# EAGLE design andromeda (EAGLE 7.7.0)
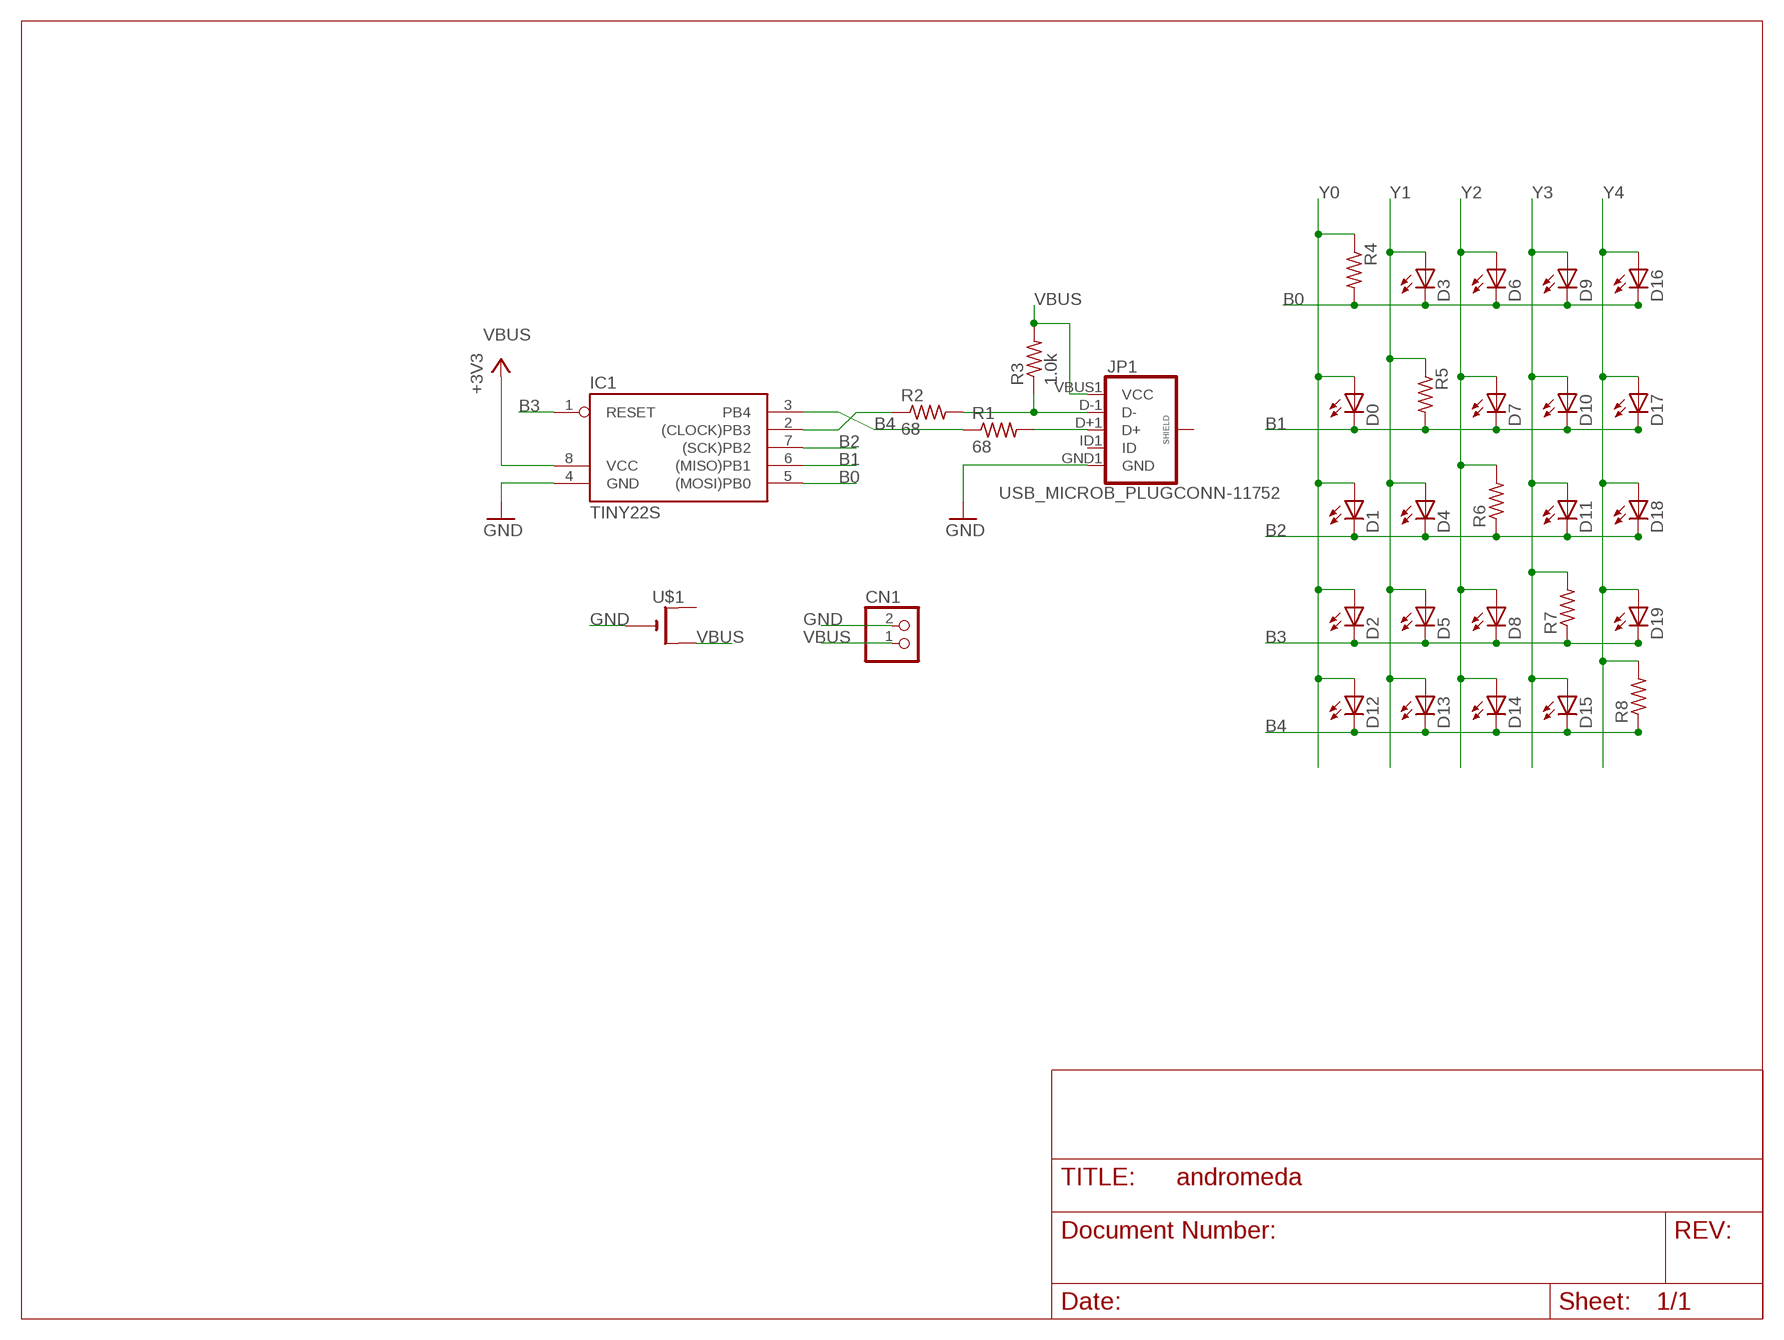
[diagram p0: schematic, sheet 1]

## Parts
CN1  JST_2PIN-THM-RA  [JST-PH-2-THM-RA]
D0  LEDCHIPLED_0805  [CHIPLED_0805]
D1  LEDCHIPLED_0805  [CHIPLED_0805]
D2  LEDCHIPLED_0805  [CHIPLED_0805]
D3  LEDCHIPLED_0805  [CHIPLED_0805]
D4  LEDCHIPLED_0805  [CHIPLED_0805]
D5  LEDCHIPLED_0805  [CHIPLED_0805]
D6  LEDCHIPLED_0805  [CHIPLED_0805]
D7  LEDCHIPLED_0805  [CHIPLED_0805]
D8  LEDCHIPLED_0805  [CHIPLED_0805]
D9  LEDCHIPLED_0805  [CHIPLED_0805]
D10  LEDCHIPLED_0805  [CHIPLED_0805]
D11  LEDCHIPLED_0805  [CHIPLED_0805]
D12  LEDCHIPLED_0805  [CHIPLED_0805]
D13  LEDCHIPLED_0805  [CHIPLED_0805]
D14  LEDCHIPLED_0805  [CHIPLED_0805]
D15  LEDCHIPLED_0805  [CHIPLED_0805]
D16  LEDCHIPLED_0805  [CHIPLED_0805]
D17  LEDCHIPLED_0805  [CHIPLED_0805]
D18  LEDCHIPLED_0805  [CHIPLED_0805]
D19  LEDCHIPLED_0805  [CHIPLED_0805]
IC1  TINY22S  [SOIC8]
JP1  USB_MICROB_PLUGCONN-11752  [USB-B-MICRO-SMD_V03]
R1  68  R-US_R0603  [R0603]
R2  68  R-US_R0603  [R0603]
R3  1.0k  R-US_R0603  [R0603]
R4  R-US_R0603  [R0603]
R5  R-US_R0603  [R0603]
R6  R-US_R0603  [R0603]
R7  R-US_R0603  [R0603]
R8  R-US_R0603  [R0603]
U$1  CR2032SMT  [CR2032-SMD]

## Nets
B0: D3.C D6.C D9.C D16.C IC1.5((MOSI)PB0) R4.2
B1: D0.C D7.C D10.C D17.C IC1.6((MISO)PB1) R5.2
B2: D1.C D4.C D11.C D18.C IC1.7((SCK)PB2) R6.1
B3: D2.C D5.C D8.C D19.C IC1.1(RESET) R7.1
B4: D12.C D13.C D14.C D15.C IC1.3(PB4) R1.1 R8.1
GND: CN1.2 IC1.4(GND) JP1.GND1(GND) U$1.-
N$1: JP1.D+1(D+) R1.2
N$2: JP1.D-1(D-) R2.2 R3.1
N$4: IC1.2((CLOCK)PB3) R2.1
VBUS: CN1.1 IC1.8(VCC) JP1.VBUS1(VCC) R3.2 U$1.+$2(+1) ; supply symbol labelled +3V3
Y0: D0.A D1.A D2.A D12.A R4.1
Y1: D3.A D4.A D5.A D13.A R5.1
Y2: D6.A D7.A D8.A D14.A R6.2
Y3: D9.A D10.A D11.A D15.A R7.2
Y4: D16.A D17.A D18.A D19.A R8.2
Unconnected: JP1.ID1(ID) JP1.SHIELD1(SHIELD) JP1.SHIELD2(SHIELD) JP1.SHIELD3(SHIELD) U$1.+$1(+)

## Library data of the parts
CN1 = adafruit:JST_2PIN: JST 2-Pin Connectors of various flavors SMT-RA (S2B-PH-SM4) 4UConnector #17311 SMT (B2B-PH-SM4) THM-RA (S2B-PH) THM (B2B-PH)
D0 D1-D19 = led:LED: LED OSRAM: - CHIPLED LG R971, LG N971, LY N971, LG Q971, LY Q971, LO R971, LY R971 LH N974, LH R974 LS Q976, LO Q976, LY Q976 LO Q996 - Hyper CHIPLED LW Q18S LB Q993, LB Q99A, LB R99A - SideLED LS A670, LO A670, LY A670, LG A670, LP A670 LB A673, LV A673, LT A673, LW A673 LH A674 LY A675 LS A676, LA A676, LO A676, LY A676, LW A676 LS A679, LY A679, LG A679 - Hyper Micro SIDELED® LS Y876, LA Y876, LO Y876, LY Y876 LT Y87S - SmartLED LW L88C, LW L88S LB L89C, LB L89S, LG L890 LS L89K, LO L89K, LY L89K LS L896, LA L896, LO L896, LY L896 - TOPLED LS T670, LO T670, LY T670, LG T670, LP T670 LSG T670, LSP T670, LSY T670, LOP T670, LYG T670 LG T671, LOG T671, LSG T671 LB T673, LV T673, LT T673, LW T673 LH T674 LS T676, LA T676, LO T676, LY T676, LB T676, LH T676, LSB T676, LW T676 LB T67C, LV T67C, LT T67C, LS T67K, LO T67K, LY T67K, LW E67C LS E67B, LA E67B, LO E67B, LY E67B, LB E67C, LV E67C, LT E67C LW T67C LS T679, LY T679, LG T679 LS T770, LO T770, LY T770, LG T770, LP T770 LB T773, LV T773, LT T773, LW T773 LH T774 LS E675, LA E675, LY E675, LS T675 LS T776, LA T776, LO T776, LY T776, LB T776 LHGB T686 LT T68C, LB T68C - Hyper Mini TOPLED® LB M676 - Mini TOPLED Santana® LG M470 LS M47K, LO M47K, LY M47K Source: http://www.osram.convergy.de LUXEON: - LUMILED® LXK2-PW12-R00, LXK2-PW12-S00, LXK2-PW14-U00, LXK2-PW14-V00 LXK2-PM12-R00, LXK2-PM12-S00, LXK2-PM14-U00 LXK2-PE12-Q00, LXK2-PE12-R00, LXK2-PE12-S00, LXK2-PE14-T00, LXK2-PE14-U00 LXK2-PB12-K00, LXK2-PB12-L00, LXK2-PB12-M00, LXK2-PB14-N00, LXK2-PB14-P00, LXK2-PB14-Q00 LXK2-PR12-L00, LXK2-PR12-M00, LXK2-PR14-Q00, LXK2-PR14-R00 LXK2-PD12-Q00, LXK2-PD12-R00, LXK2-PD12-S00 LXK2-PH12-R00, LXK2-PH12-S00 LXK2-PL12-P00, LXK2-PL12-Q00, LXK2-PL12-R00 Source: www.luxeon.com KINGBRIGHT: KA-3528ASYC Source: www.kingbright.com
IC1 = atmel:TINY22: MICROCONTROLLER 1K ROM 128 bytes RAM 128 bytes EEPROM; OC_FARNELL: unknown; OC_NEWARK: unknown
JP1 = SparkFun-Connectors:USB_MICROB_PLUG: USB Micro-B connectors Some male, some female. Watch your step!; PROD_ID: CONN-11752
R1-R8 = resistor:R-US_: RESISTOR, American symbol
U$1 = adafruit:CR2032

## Net classes
0 default: width 0.406 mm

## Board
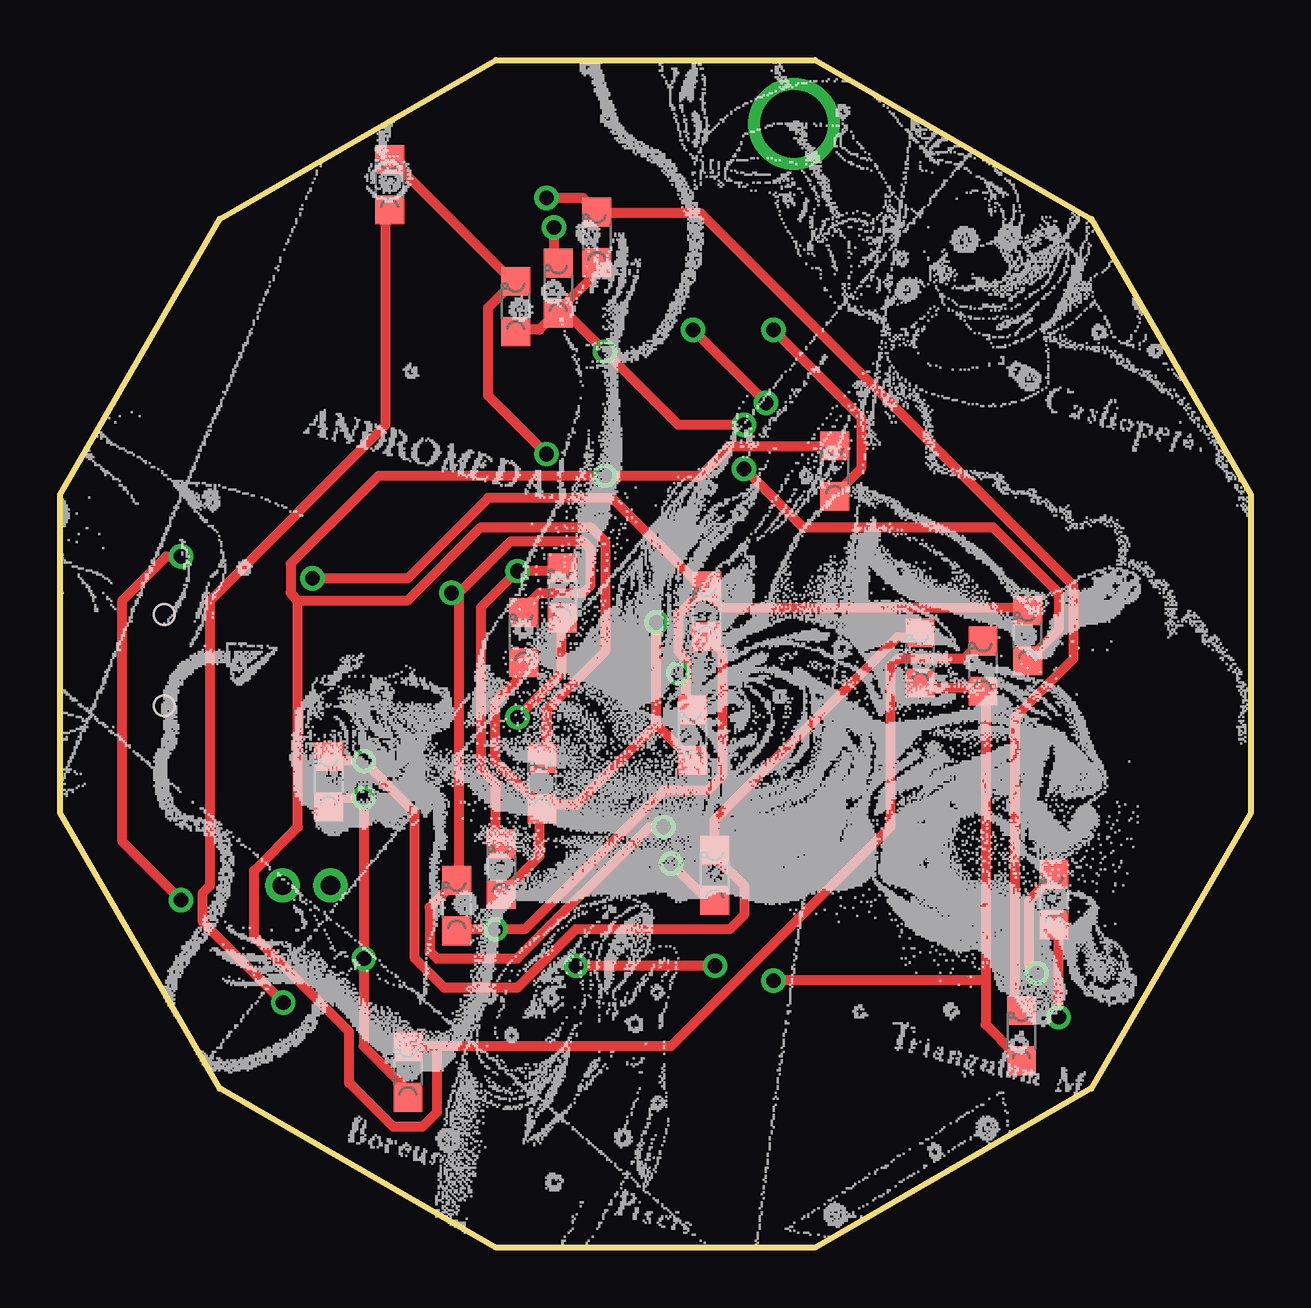
[diagram p1: board, top side]
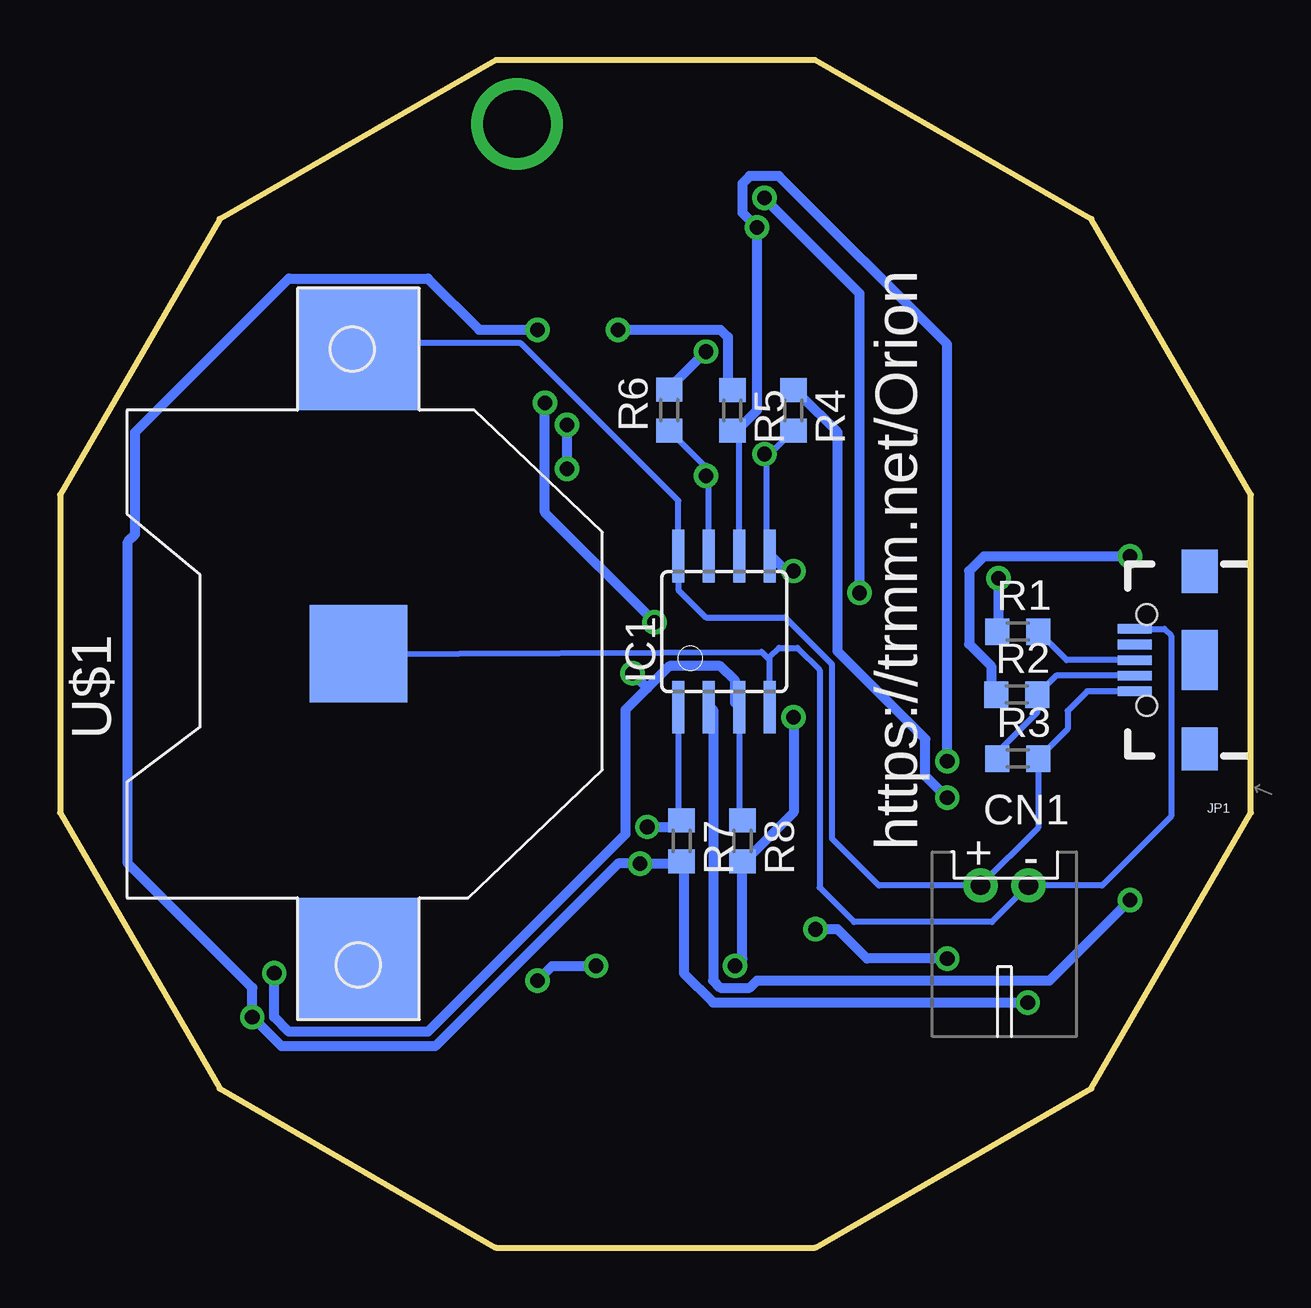
[diagram p2: board, bottom side, seen from below]

Size 49.62 x 49.5 mm. Coordinates in mm from the lower left corner, seen from the top.
Outline: 31.46,0 18.16,0 6.65,6.63 0,18.12 0,31.38 6.65,42.87 18.16,49.5 31.46,49.5 42.98,42.87 49.62,31.38 49.62,18.12 42.98,6.63 31.46,0
Copper layers (1*16): Top 0.035mm / dielectric 1.5mm / Bottom 0.035mm
Design rules "default": minimum track width 10mil, minimum drill 24mil, track to track 8mil, track to pad 8mil, pad to pad 8mil, via to via 8mil, smd to smd 8mil, copper to edge 40mil, drill to drill 8mil, minimum pad ring 10mil, minimum via ring 8mil, stop-mask expansion 4mil, vias tented up to drill 0mil, thermal gap 10mil
bRestrict: area 28.1,15.3 to 46.2,34.2
vRestrict: area 26.4,14.4 to 46.8,35.4

### Footprints (pad centres in the part's own frame; a part is rotated, then mirrored left to right if it is on the bottom)
JST-PH-2-THM-RA = drill 0.8 pad 1.422: 1 1,0; 2 -1,0
CHIPLED_0805 = smd 1.2 x 1.2: A 0,-1.05; C 0,1.05
SOIC8 = smd 0.5 x 2.2: 1 -1.905,-3.154; 2 -0.645,-3.154; 3 0.625,-3.154; 4 1.895,-3.154; 5 1.905,3.154; 6 0.635,3.154; 7 -0.635,3.154; 8 -1.905,3.154
USB-B-MICRO-SMD_V03 = smd 1.4 x 0.4: D+1 2.7,0; D-1 2.7,0.65; GND1 2.7,-1.3; ID1 2.7,-0.65; VBUS1 2.7,1.3 | smd 1.5 x 1.8: SHIELD1 0,3.7; SHIELD2 0,-3.7 | smd 1.5 x 2.5: SHIELD3 0,0 | hole 0.85: 2.2,1.9; 2.2,-1.9
R0603 = smd 1 x 1.1: 1 -0.85,0; 2 0.85,0
CR2032-SMD = smd 5.08 x 5.08: +$1 -12.7,0; +$2 12.7,0 | smd 4.064 x 4.064: - 0,0

### Placement (x,y rotation side)
CN1  10.27,15.09 180 bottom
D0  11.2,19.41 0 top
D1  14.5,7.31 0 top
D2  16.53,14.25 0 top
D3  18.39,15.77 0 top
D4  20.08,19.33 0 top
D5  19.32,25.43 0 top
D6  18.99,39.22 0 top
D7  20.76,39.99 0 top
D8  22.37,42.1 0 top
D9  13.74,44.3 0 top
D10  27.28,15.52 0 top
D11  32.28,32.37 0 top
D12  26.94,26.52 0 top
D13  26.35,21.36 0 top
D14  40.32,25.51 0 top
D15  41.42,14.5 0 top
D16  20.93,27.29 0 top
D17  35.83,24.58 0 top
D18  38.46,24.24 0 top
D19  40.06,8.83 0 top
IC1  21.95,25.68 0 bottom
JP1  2.14,24.49 180 bottom
R1  9.71,25.68 0 bottom
R2  9.76,23.05 0 bottom
R3  9.72,20.39 0 bottom
R4  19.07,34.9 270 bottom
R5  21.61,34.9 270 bottom
R6  24.24,34.91 90 bottom
R7  23.73,16.95 270 bottom
R8  21.19,16.95 270 bottom
U$1  37.19,24.74 90 bottom

### Tracks (layer width: path | path; a pad name or v marks a point on that pad's centre or on a via)
B0  (via drill 0.61)
  Top 0.406: D9.C 13.88,45.27 18.75,40.39 D6.C 18.75,40.09 17.84,39.17 17.84,35.52 v20.28,33.08 | D3.C 18.14,16.92 18.14,19.36 17.53,19.97 17.53,26.68 v19.06,28.2 20.89,28.2 D16.C
  Bottom 0.254: IC1.5 20.04,28.85 20.17,28.98 20.17,32.95 20.01,33.11 R4.2
  Bottom 0.406: v19.06,28.2 19.36,28.2 19.97,28.81 IC1.5 | v20.28,33.08 19.97,33.08 20.01,33.11
B1  (via drill 0.61)
  Top 0.406: v20.58,42.53 20.58,41.31 D7.C | D0.C 11.44,20.28 v12.66,20.28 14.79,18.14 14.79,12.05 16.01,10.83 19.06,10.83 21.5,13.27 27.9,13.27 28.51,13.88 28.51,15.09 27.29,16.31 D10.C 27.29,16.62 27.29,17.84 34.91,25.46 35.82,25.46 D17.C
  Bottom 0.254: IC1.6 21.31,33.75 R5.2
  Bottom 0.406: R5.2 21.5,33.99 20.58,34.91 v20.58,42.53 21.19,43.14 21.19,44.36 20.89,44.66 19.67,44.66 12.66,37.65 v12.66,20.28
B2  (via drill 0.61)
  Top 0.406: 9.91,26.98 14.48,26.98 17.53,30.03 22.1,30.03 22.71,29.42 22.71,24.85 20.28,22.41 20.28,20.58 D4.C | 9.91,26.98 9.61,27.29 9.61,28.51 13.27,32.16 v22.71,32.16 26.68,32.16 27.9,33.38 32.16,33.38 D11.C | 15.7,8.39 25.46,8.39 34.6,17.53 34.6,24.24 34.91,24.54 37.65,24.54 38.26,25.15 D18.C | 15.7,8.39 14.79,8.39 D1.C | 9.91,26.98 9.91,17.53 8.08,15.7 8.08,12.96 12.05,9 12.05,6.86 13.88,5.04 15.09,5.04 15.7,5.65 15.7,8.39
  Bottom 0.254: IC1.7 22.58,32.4 22.68,32.5 R6.1
  Bottom 0.406: v22.71,32.16 22.71,32.47 22.68,32.5
B3  (via drill 0.61)
  Top 0.406: 16.62,27.29 16.62,15.4 D2.C 16.31,15.09 15.4,14.18 15.4,12.35 15.7,12.05 19.06,12.05 24.54,17.53 v25.15,17.53 | 16.62,27.29 18.75,29.42 21.8,29.42 22.1,29.12 22.1,27.59 21.8,27.29 19.97,27.29 19.36,26.68 D5.C | D19.C 39.78,9.91 39.78,22.1 42.22,24.54 42.22,27.59 26.68,43.14 22.41,43.14 D8.C 22.1,43.44 21.8,43.75 v20.28,43.75 | v16.31,27.29 16.62,27.29
  Bottom 0.254: IC1.1 23.85,17.93 R7.1
  Bottom 0.406: v25.15,17.53 23.93,17.53 R7.1 | v16.31,27.29 16.31,39.78 v20.28,43.75
B4  (via drill 0.61)
  Top 0.406: v40.7,11.44 40.39,11.74 40.39,14.48 41.31,15.4 D15.C | v10.52,27.9 14.48,27.9 17.84,31.25 23.02,31.25 26.68,27.59 D12.C | 26.07,23.93 26.07,24.54 25.76,24.85 25.76,26.37 26.68,27.29 D12.C | 26.07,23.93 26.07,22.71 D13.C | D14.C 40.09,26.68 27.59,26.68 26.98,27.29 D12.C | 26.07,23.93 v25.76,23.93
  Bottom 0.254: IC1.3 21.32,17.94 R8.1
  Bottom 0.406: v40.7,11.44 40.7,9.61 40.09,9 34.3,9 26.07,17.23 26.07,22.41 25.15,23.32 | 25.15,23.32 24.24,24.24 22.1,24.24 21.5,23.63 21.5,22.71 IC1.3 | v10.52,27.9 10.52,25.76 R1.1 | v25.76,23.93 25.15,23.32
GND
  Bottom 0.254: JP1.GND1 3.61,25.79 3.33,25.51 3.33,17.97 6.2,15.09 CN1.2 10.79,13.57 16.53,13.57 17.97,15.01 17.97,24.07 18.9,25 19.66,25 20.05,24.61 20.05,24.49 | IC1.4 20.05,24.49 | U$1.- 20.39,24.83 20.05,24.49
N$1
  Bottom 0.254: JP1.D+1 7.68,24.49 R1.2
N$2
  Bottom 0.254: JP1.D-1 8.12,23.84 R2.2 8.91,22.3 10.56,20.64 R3.1
N$3  (via drill 2.8)
  other vias: 30.59,46.84
N$4  (via drill 0.61)
  Top 0.406: v5.04,28.81 4.43,28.81 2.6,26.98 2.6,16.92 v5.04,14.48
  Bottom 0.406: v5.04,28.81 11.13,28.81 11.74,28.2 11.74,25.15 10.83,24.24 10.83,23.32 R2.1 | v5.04,14.48 8.39,11.13 20.58,11.13 20.89,10.83 22.1,10.83 22.41,11.13 22.41,22.41 IC1.2
VBUS
  Bottom 0.254: JP1.VBUS1 6.83,23.19 7.64,22.37 7.64,21.61 R3.2 8.86,17.5 CN1.1 15.5,15.09 17.46,17.05 17.46,24.32 19.41,26.27 22.71,26.27 23.85,27.41 IC1.8 23.85,31.13 30.42,37.7 36.94,37.7 U$1.+$2
Y0  (via drill 0.61)
  Top 0.406: D2.A 16.62,13.27 v18.14,13.27 19.36,13.27 25.15,19.06 26.98,19.06 27.59,19.67 27.59,24.85 26.98,25.46 D12.A | D0.A 11.44,18.45 11.74,18.75 v12.66,18.75 v12.66,12.05 12.66,8.39 14.48,6.56 D1.A
  Bottom 0.406: v12.66,18.75 13.57,19.67 13.57,21.19 17.23,24.85 17.23,33.99 18.75,35.52 19.06,35.52 R4.1 | v18.14,13.27 17.23,13.27 16.01,12.05 v12.66,12.05
Y1  (via drill 0.61)
  Top 0.406: D3.A 18.45,14.79 19.97,16.31 19.97,18.14 D4.A | D5.A 19.06,24.24 19.06,23.63 18.14,22.71 18.14,20.28 19.97,18.45 D4.A | v29.42,35.21 v26.37,38.26 | 24.85,21.8 v24.85,26.07 | 24.85,21.8 26.07,20.58 D13.A | 24.85,21.8 21.5,18.45 20.28,18.45 D4.A
  Bottom 0.406: v26.37,38.26 22.1,38.26 21.8,37.95 21.8,35.82 R5.1 | v29.42,35.21 29.42,30.64 v24.85,26.07
Y2  (via drill 0.61)
  Top 0.406: 20.89,39.17 v22.71,37.34 25.76,34.3 v28.51,34.3 | v28.51,32.47 30.94,30.03 38.87,30.03 41.61,27.29 41.61,25.76 40.39,24.54 D14.A | D6.A 19.06,38.26 19.97,38.26 20.58,38.87 D7.A 20.89,39.17 | 20.89,39.17 22.1,40.39 22.1,41 D8.A
  Bottom 0.406: v22.71,37.34 24.24,35.82 R6.2 | v28.51,34.3 v28.51,32.47
Y3  (via drill 0.61)
  Top 0.406: v25.46,16.01 26.98,14.48 D10.A | v41.61,9.61 41.61,13.27 D15.A | v9.3,10.22 5.95,13.57 5.95,14.79 6.26,15.09 6.26,26.98 13.57,34.3 13.57,43.14 D9.A | v29.72,38.26 33.38,34.6 33.38,32.47 32.47,31.55 D11.A
  Bottom 0.406: v9.3,10.22 22.41,10.22 23.63,11.44 23.63,16.01 R7.2 23.93,16.01 v25.46,16.01 26.37,16.01 33.99,8.39 40.39,8.39 v41.61,9.61 41.61,10.83 46.79,16.01 46.79,29.42 46.49,29.72 46.49,33.99 40.09,40.39 34.3,40.39 32.16,38.26 v29.72,38.26
Y4  (via drill 0.61)
  Top 0.406: v19.06,22.1 20.89,23.93 20.89,26.07 D16.A | 38.56,11.13 38.56,23.02 D18.A 38.26,23.32 36.13,23.32 D17.A | 38.56,11.13 38.56,9.3 39.78,8.08 D19.A | v27.29,11.74 v21.5,11.74 | 38.56,11.13 v29.72,11.13
  Bottom 0.406: v19.06,22.1 19.06,18.14 20.89,16.31 R8.2 21.19,16.01 21.19,12.05 v21.5,11.74 | v27.29,11.74 29.12,11.74 v29.72,11.13

### Text on the board
bNames: https://trmm.net/Orion